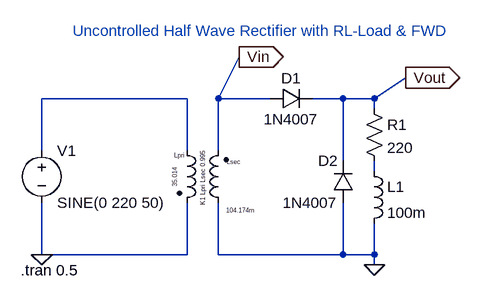
[diagram p0: schematic RLLoad with FWD.asc]
RLLoad with FWD.asc, the LTspice schematic file:
Version 4
SHEET 1 880 680
WIRE 96 48 -128 48
WIRE 144 48 176 -16
WIRE 224 48 144 48
WIRE 336 48 288 48
WIRE 384 48 432 16
WIRE 384 48 336 48
WIRE 384 64 384 48
WIRE -128 128 -128 48
WIRE 96 128 96 48
WIRE 144 128 144 48
WIRE 336 144 336 48
WIRE 384 160 384 144
WIRE -128 288 -128 208
WIRE 96 288 96 208
WIRE 96 288 -128 288
WIRE 144 288 144 208
WIRE 336 288 336 208
WIRE 336 288 144 288
WIRE 384 288 384 240
WIRE 384 288 336 288
WIRE 384 304 384 288
FLAG 432 16 Vout
IOPIN 432 16 Out
FLAG -128 288 0
FLAG 176 -16 Vin
IOPIN 176 -16 Out
FLAG 384 304 0
SYMBOL voltage -128 112 R0
WINDOW 123 0 0 Left 0
WINDOW 39 0 0 Left 0
SYMATTR InstName V1
SYMATTR Value SINE(0 220 50)
SYMBOL ind2 80 112 R0
WINDOW 0 -4 23 Left 0
WINDOW 3 -3 72 VLeft 0
SYMATTR InstName Lpri
SYMATTR Value 35.014
SYMATTR Type ind
SYMATTR SpiceLine Rser=0.5
SYMBOL diode 224 64 R270
WINDOW 0 32 32 VTop 2
WINDOW 3 0 32 VBottom 2
SYMATTR InstName D1
SYMATTR Value 1N4007
SYMBOL res 368 48 R0
SYMATTR InstName R1
SYMATTR Value 220
SYMBOL ind2 160 224 R180
WINDOW 0 -18 79 Left 0
WINDOW 3 -41 4 Left 0
SYMATTR InstName Lsec
SYMATTR Value 104.174m
SYMATTR Type ind
SYMATTR SpiceLine Rser=0.1
SYMBOL ind 368 144 R0
SYMATTR InstName L1
SYMATTR Value 100m
SYMBOL diode 352 208 R180
WINDOW 0 24 64 Left 2
WINDOW 3 24 0 Left 2
SYMATTR InstName D2
SYMATTR Value 1N4007
TEXT -160 312 Left 2 !.tran 0.5
TEXT 120 128 VRight 0 !K1 Lpri Lsec 0.995
TEXT -80 -56 Left 2 ;Uncontrolled Half Wave Rectifier with RL-Load & FWD

The netlist it stands for:
* RLLoad with FWD.asc
V1 N001 0 SINE(0 220 50)
Lpri N001 0 35.014 Rser=0.5
D1 Vin Vout 1N4007
R1 Vout N002 220
Lsec 0 Vin 104.174m Rser=0.1
L1 N002 0 100m
D2 0 Vout 1N4007
.model D D
.lib standard.dio
.tran 0.5
K1 Lpri Lsec 0.995
* Uncontrolled Half Wave Rectifier with RL-Load & FWD
.backanno
.end